# EAGLE design Player (EAGLE 7.4.0)
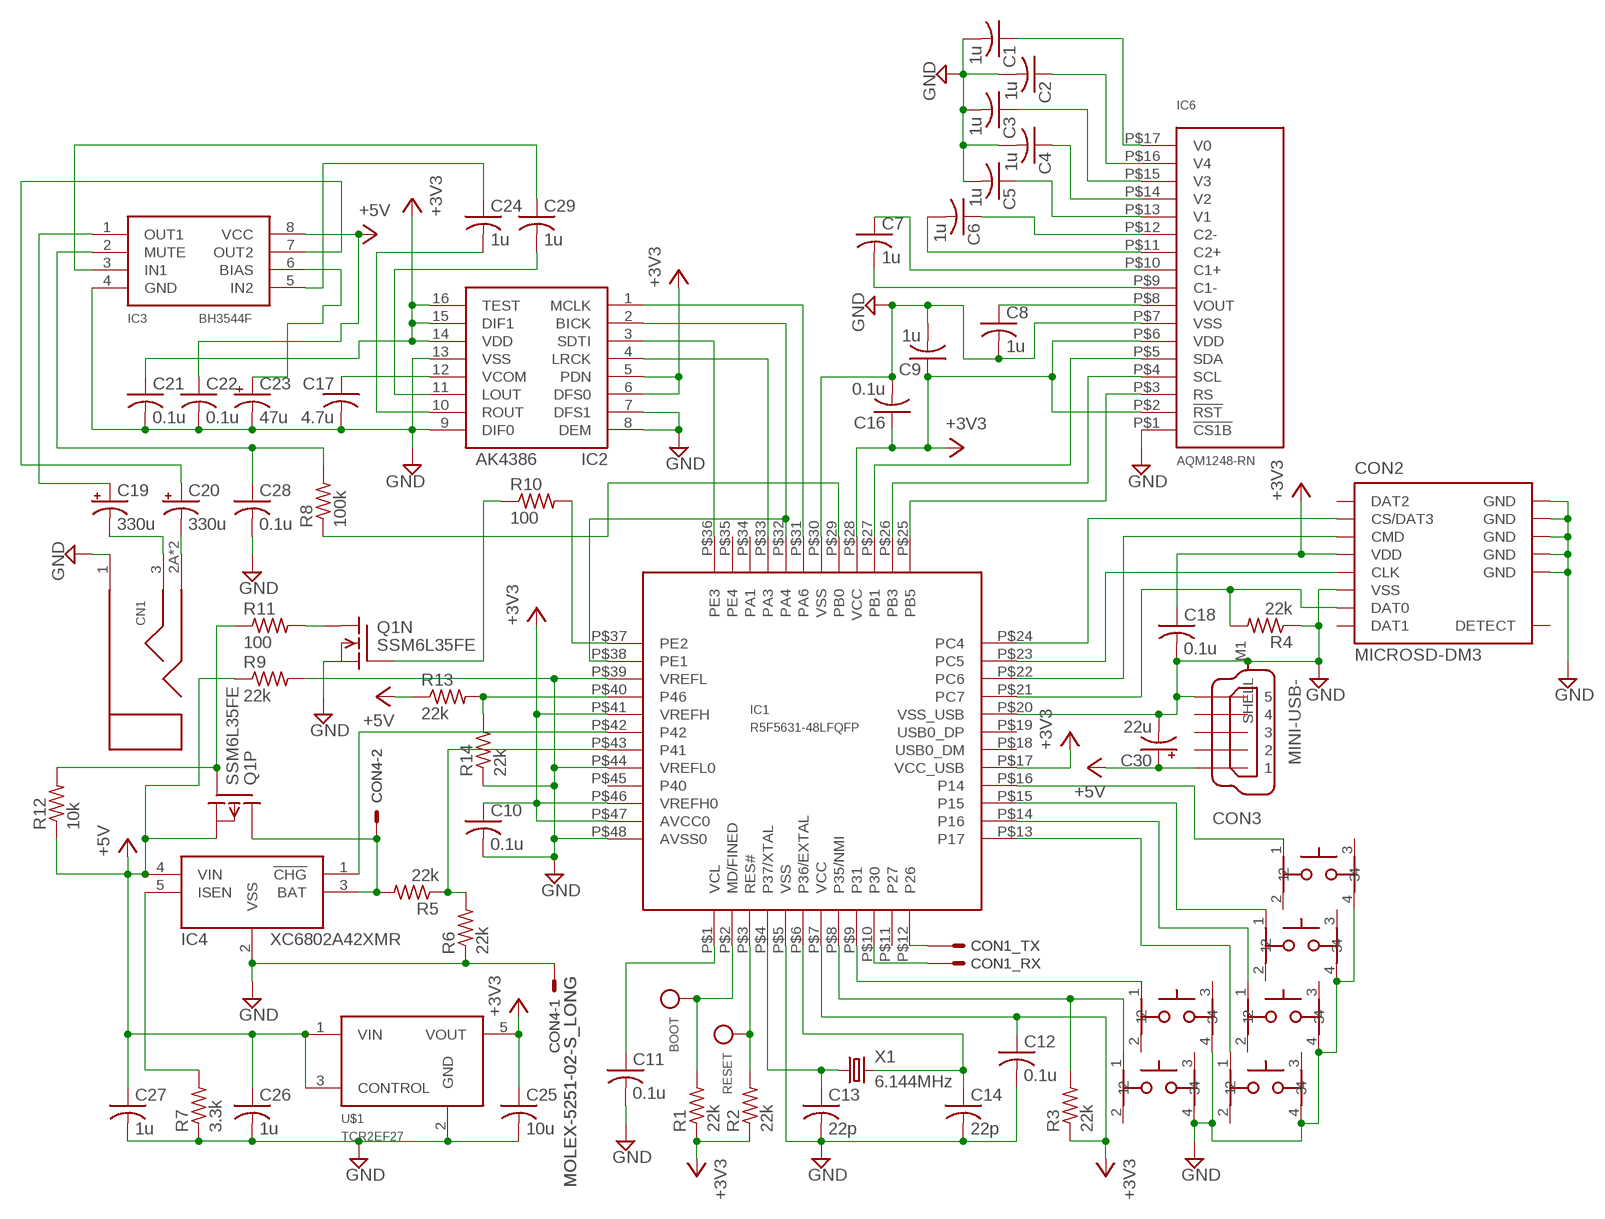
[diagram p0: schematic, sheet 1]

## Parts
BOOT  CHECK_PIN  [SLC-22-G]
C1  1u  C-2012  [2012-C]
C2  1u  C-2012  [2012-C]
C3  1u  C-2012  [2012-C]
C4  1u  C-2012  [2012-C]
C5  1u  C-2012  [2012-C]
C6  1u  C-2012  [2012-C]
C7  1u  C-2012  [2012-C]
C8  1u  C-2012  [2012-C]
C9  1u  C-2012  [2012-C]
C10  0.1u  C-2012  [2012-C]
C11  0.1u  C-2012  [2012-C]
C12  0.1u  C-2012  [2012-C]
C13  22p  C-1608  [1608]
C14  22p  C-1608  [1608]
C16  0.1u  C-2012  [2012-C]
C17  4.7u  C-2012  [2012-C]
C18  0.1u  C-2012  [2012-C]
C19  330u  CC-2.5-8  [E2,5-8]
C20  330u  CC-2.5-8  [E2,5-8]
C21  0.1u  C-2012  [2012-C]
C22  0.1u  C-2012  [2012-C]
C23  47u  CC-2.5-8  [E2,5-8]
C24  1u  C-2012  [2012-C]
C25  10u  C-3216  [3216]
C26  1u  C-2012  [2012-C]
C27  1u  C-2012  [2012-C]
C28  0.1u  C-2012  [2012-C]
C29  1u  C-2012  [2012-C]
C30  22u  CC-2.5-8  [E2,5-8]
CN1  STEREO-3.5-MJ8435  [MJ8435]
CON1  UART-S  [IL-G-04-S]
CON2  MICROSD-DM3  [DM3AT-SF-PEJ]
CON3  MINI-USB-  [UX60A-MB-5ST]
CON4  MOLEX-5251-02-S_LONG  [5251-02-S_LONG]
IC1  R5F5631-48LFQFP  [P-LFQFP48-7X7-0.50]
IC2  AK4386  [TSSOP16]
IC3  BH3544F  [SOIC8]
IC4  XC6802A42XMR  [SOT23-5]
IC6  AQM1248-RN  [AQM1248A-RN]
Q1  SSM6L35FE  [2-2N1D]
R1  22k  R-2012  [2012-R]
R2  22k  R-2012  [2012-R]
R3  22k  R-2012  [2012-R]
R4  22k  R-2012  [2012-R]
R5  22k  R-2012  [2012-R]
R6  22k  R-2012  [2012-R]
R7  3.3k  R-2012  [2012-R]
R8  100k  R-2012  [2012-R]
R9  22k  R-2012  [2012-R]
R10  100  R-2012  [2012-R]
R11  100  R-2012  [2012-R]
R12  10k  R-2012  [2012-R]
R13  22k  R-2012  [2012-R]
R14  22k  R-2012  [2012-R]
RESET  CHECK_PIN  [SLC-22-G]
SW1  PUSHSW  [PUSHSW]
SW2  PUSHSW  [PUSHSW]
SW3  PUSHSW  [PUSHSW]
SW4  PUSHSW  [PUSHSW]
SW5  PUSHSW  [PUSHSW]
SW6  PUSHSW  [PUSHSW]
U$1  TCR2EF27  TCR2EF  [5-LEAD_TSOT]
X1  6.144MHz  CRYSTALTINY  [TINYCRYSTAL]

## Nets
+3V3: C9.1 C10.1 C12.1 C16.1 C18.1 C21.1 C25.1 CON2.4(VDD) IC1.P$7(VCC) IC1.P$17(VCC_USB) IC1.P$28(VCC) IC1.P$41(VREFH) IC1.P$46(VREFH0) IC1.P$47(AVCC0) IC2.5(PDN) IC2.6(DFS0) IC2.14(VDD) IC2.15(DIF1) IC2.16(TEST) IC6.P$2(!RST) IC6.P$6(VDD) R1.1 R2.1 R3.1 U$1.5(VOUT)
+5V: C22.1 C26.1 C27.1 C30.+ CON3.1 IC3.8(VCC) IC4.4(VIN) Q1.4(P:S) R9.1 R12.1 R13.1 U$1.1(VIN) U$1.3(CONTROL)
GND: C1.2 C2.2 C3.2 C4.2 C5.2 C8.2 C9.2 C10.2 C11.2 C12.2 C13.2 C14.2 C16.2 C17.2 C18.2 C21.2 C22.2 C23.- C25.2 C26.2 C27.2 C28.2 C30.- CN1.1(SLEEVE) CON2.6(VSS) CON2.SHELL1(GND) CON2.SHELL2(GND) CON2.SHELL3(GND) CON2.SHELL4(GND) CON2.SHELL5(GND) CON3.5 CON3.M1(SHELL) CON4.1 IC1.P$5(VSS) IC1.P$20(VSS_USB) IC1.P$30(VSS) IC1.P$39(VREFL) IC1.P$44(VREFL0) IC1.P$48(AVSS0) IC2.7(DFS1) IC2.8(DEM) IC2.9(DIF0) IC2.13(VSS) IC3.4(GND) IC4.2(VSS) IC6.P$1(!CS1B) IC6.P$7(VSS) Q1.1(N:S) R4.1 R6.1 R7.1 R9.2 R14.1 SW1.4 SW2.4 SW3.4 SW4.4 SW5.4 SW6.4 U$1.2(GND)
N$1: C1.1 IC6.P$17(V0)
N$2: C2.1 IC6.P$16(V4)
N$3: C3.1 IC6.P$15(V3)
N$4: C4.1 IC6.P$14(V2)
N$5: C5.1 IC6.P$13(V1)
N$6: C11.1 IC1.P$1(VCL)
N$7: C6.1 IC6.P$12(C2-)
N$8: C6.2 IC6.P$11(C2+)
N$9: C7.1 IC6.P$10(C1+)
N$10: C7.2 IC6.P$9(C1-)
N$11: C8.1 IC6.P$8(VOUT)
N$12: CON1.3(_TX:S) IC1.P$12(P26)
N$13: CON1.2(_RX:S) IC1.P$10(P30)
N$14: IC1.P$9(P31) SW2.1
N$15: IC1.P$8(P35/NMI) R3.2 SW1.1
N$16: CON2.5(CLK) IC1.P$23(PC5)
N$18: IC1.P$37(PE2) R10.2
N$19: Q1.2(N:G) R10.1
N$20: IC1.P$3(RES#) R2.2 RESET.SIGNAL
N$21: Q1.5(P:G) R11.1 R12.2
N$23: CON2.7(DAT0) IC1.P$21(PC7) R4.2
N$24: BOOT.SIGNAL IC1.P$2(MD/FINED) R1.2
N$25: IC1.P$16(P14) SW6.1
N$26: IC1.P$15(P15) SW5.1
N$27: IC1.P$14(P16) SW4.1
N$28: IC1.P$13(P17) SW3.1
N$29: CON2.3(CMD) IC1.P$22(PC6)
N$30: CON2.2(CS/DAT3) IC1.P$24(PC4)
N$31: C17.1 IC2.12(VCOM)
N$32: IC1.P$25(PB5) IC6.P$3(RS)
N$33: IC1.P$26(PB3) IC6.P$4(SCL)
N$34: IC1.P$27(PB1) IC6.P$5(SDA)
N$35: C24.2 IC2.10(ROUT)
N$36: C29.2 IC2.11(LOUT)
N$37: C20.+ IC3.7(OUT2)
N$38: C23.+ IC3.6(BIAS)
N$39: C19.+ IC3.1(OUT1)
N$40: C19.- CN1.3(RING)
N$41: C20.- CN1.2A(TIP) CN1.2B(TIP)
N$42: IC1.P$36(PE3) IC2.3(SDTI)
N$43: IC1.P$31(PA6) IC2.1(MCLK)
N$44: IC1.P$32(PA4) IC1.P$38(PE1) IC2.2(BICK)
N$45: IC1.P$33(PA3) IC2.4(LRCK)
N$46: C24.1 IC3.5(IN2)
N$47: Q1.6(N:D) R11.2
N$48: IC1.P$43(P41) R5.1 R6.2
N$49: IC1.P$42(P42) IC4.1(!CHG!)
N$50: CON4.2 IC4.3(BAT) Q1.3(P:D) R5.2
N$51: C29.1 IC3.3(IN1)
N$52: IC4.5(ISEN) R7.2
N$53: C28.1 IC3.2(MUTE) R8.2
N$54: IC1.P$29(PB0) R8.1
N$55: IC1.P$40(P46) R13.2 R14.2
N$56: C13.1 IC1.P$4(P37/XTAL) X1.1
N$57: C14.1 IC1.P$6(P36/EXTAL) X1.2
Unconnected: CON2.1(DAT2) CON2.8(DAT1) CON2.DETECT CON3.2 CON3.3 CON3.4 IC1.P$11(P27) IC1.P$18(USB0_DM) IC1.P$19(USB0_DP) IC1.P$34(PA1) IC1.P$35(PE4) IC1.P$45(P40) SW1.2 SW1.3 SW2.2 SW2.3 SW3.2 SW3.3 SW4.2 SW4.3 SW5.2 SW5.3 SW6.2 SW6.3

## Power pins joined to a net without a drawn wire
GND: CON1.1(_PWR:GND)
VCC: CON1.4(_PWR:VCC)

## Library data of the parts
BOOT RESET = Connector_Robotech:CHECK_PIN
C1-C14 C16-C18 C21 C22 C24-C29 = Passive_Robotech:C
C19 C20 C23 C30 = Passive_Robotech:CC
CN1 = Connector_Robotech:STEREO
CON1 = Connector_Robotech:UART: Robotech Universal Asynchronous Receiver Transmitter
CON2 = Connector_Robotech:MICROSD: microSD connector
CON3 = Connector_Robotech:MINI-USB-: MINI USB Connector Source: http://www.hirose.co.jp/cataloge_hp/e24000019.pdf
CON4 = Connector_Robotech:MOLEX-5251-02: CONNECTOR wire to board 2.54 mm (.1 inch) pitch header
IC1 = MicroControler_Robotech:R5F5631-48LFQFP
IC2 = IC_Robotech:AK4386
IC3 = IC_Robotech:BH3544F
IC4 = IC_Robotech:XC6802
IC6 = IC_Robotech:AQM1248-RN
Q1 = Transistor_Robotech:SSM6L35FE
R1-R14 = Passive_Robotech:R
SW1-SW6 = Passive_Robotech:PUSHSW
U$1 = IC_Robotech:TCR2EF
X1 = Passive_Robotech:CRYSTAL: CRYSTAL

## Board
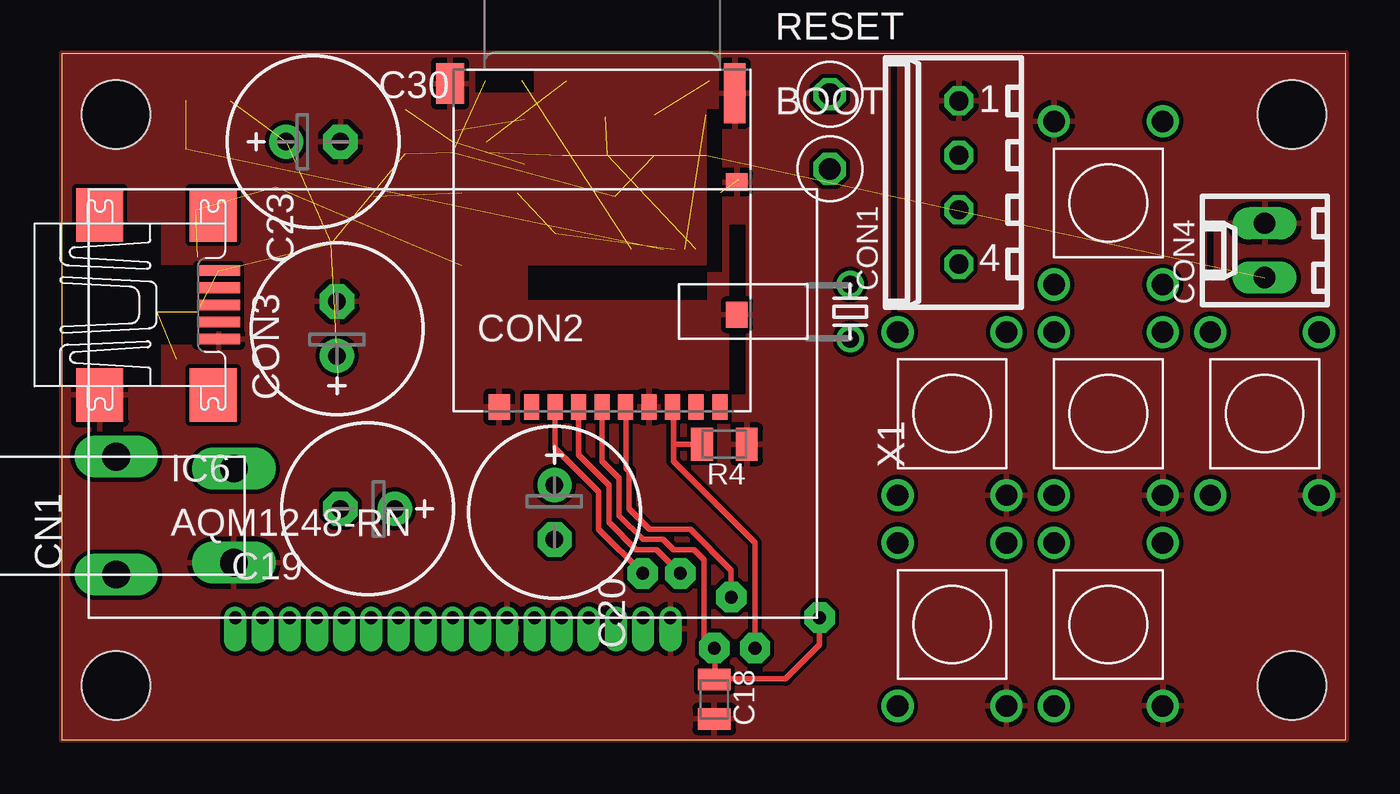
[diagram p1: board, top side]
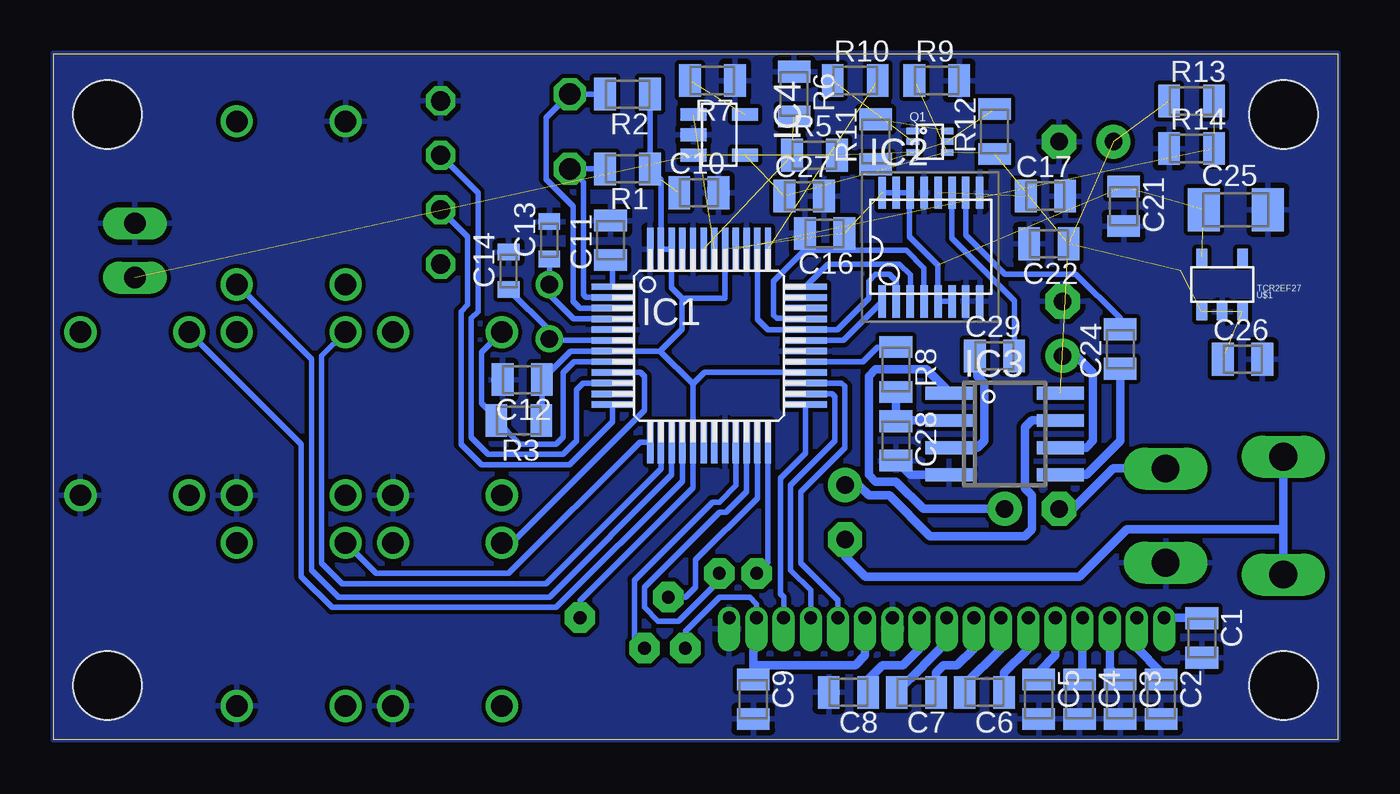
[diagram p2: board, bottom side, seen from below]

Size 59.99 x 32.06 mm. Coordinates in mm from the lower left corner, seen from the top.
Outline: 0,0 59.99,0 59.99,32.06 0,32.06 0,0
Copper layers (1*16): Top 0.0356mm / dielectric 1.5011mm / Bottom 0.0356mm
Design rules "formitaminimum *": minimum track width 5mil, minimum drill 0.5994mm, track to track 0.2007mm, track to pad 0.2007mm, pad to pad 0.2007mm, via to via 0.2007mm, smd to smd 0mil, copper to edge 0mil, drill to drill 1mil, minimum pad ring 9mil, minimum via ring 8mil, stop-mask expansion 4mil, vias tented up to drill 0mil, thermal gap 10mil
Holes 3.2 mm at 2.54,2.54 57.47,2.54 57.47,29.21 2.54,29.21

### Footprints (pad centres in the part's own frame; a part is rotated, then mirrored left to right if it is on the bottom)
SLC-22-G = drill 1 octagon: SIGNAL 0,0
2012-C = smd 1.016 x 1.524: 1 -0.921,0; 2 0.921,0
1608 = smd 0.762 x 1.016: 1 -0.875,0; 2 0.875,0
E2,5-8 = drill 0.813 pad 1.6: + -1.27,0 | drill 0.813 pad 1.6 octagon: - 1.27,0
3216 = smd 1.5 x 2: 1 -1.5,0; 2 1.5,0
MJ8435 = drill 1.3 long: 1 -2.2,-5.5; 2A -2.75,0; 2B 2.75,0; 3 2.2,-5.5
IL-G-04-S = drill 0.9 octagon: 1 3.81,0; 2 1.27,0; 3 -1.27,0; 4 -3.81,0
DM3AT-SF-PEJ = smd 0.7 x 1.2: 1 3.3,0; 2 2.2,0; 3 1.1,0; 4 0,0; 5 -1.1,0; 6 -2.2,0; 7 -3.3,0; 8 -4.4,0; DETECT -5.5,0 | smd 1 x 1.2: SHELL1 4.8,0; SHELL2 -6.3,-4.3 | smd 1 x 0.8: SHELL3 -6.3,-10.5 | smd 1 x 2.8: SHELL4 -6.2,-14.65 | smd 1.3 x 1.9: SHELL5 7.1,-15.1
UX60A-MB-5ST = smd 2 x 0.5: 1 2.25,1.6; 2 2.25,0.8; 3 2.25,0; 4 2.25,-0.8; 5 2.25,-1.6 | smd 2.2 x 2.5: M1 -3.3,-4.2; M2 -3.3,4.2; M3 2,4.2; M4 2,-4.2
5251-02-S_LONG = drill 1 long: 1 1.27,0; 2 -1.27,0
P-LFQFP48-7X7-0.50 = smd 2 x 0.3: P$1 -4.5,2.75; P$2 -4.5,2.25; P$3 -4.5,1.75; P$4 -4.5,1.25; P$5 -4.5,0.75; P$6 -4.5,0.25; P$7 -4.5,-0.25; P$8 -4.5,-0.75; P$9 -4.5,-1.25; P$10 -4.5,-1.75; P$11 -4.5,-2.25; P$12 -4.5,-2.75; P$25 4.5,-2.75; P$26 4.5,-2.25; P$27 4.5,-1.75; P$28 4.5,-1.25; P$29 4.5,-0.75; P$30 4.5,-0.25; P$31 4.5,0.25; P$32 4.5,0.75; P$33 4.5,1.25; P$34 4.5,1.75; P$35 4.5,2.25; P$36 4.5,2.75 | smd 0.3 x 2: P$13 -2.75,-4.5; P$14 -2.25,-4.5; P$15 -1.75,-4.5; P$16 -1.25,-4.5; P$17 -0.75,-4.5; P$18 -0.25,-4.5; P$19 0.25,-4.5; P$20 0.75,-4.5; P$21 1.25,-4.5; P$22 1.75,-4.5; P$23 2.25,-4.5; P$24 2.75,-4.5; P$37 2.75,4.5; P$38 2.25,4.5; P$39 1.75,4.5; P$40 1.25,4.5; P$41 0.75,4.5; P$42 0.25,4.5; P$43 -0.25,4.5; P$44 -0.75,4.5; P$45 -1.25,4.5; P$46 -1.75,4.5; P$47 -2.25,4.5; P$48 -2.75,4.5
TSSOP16 = smd 0.35 x 1.5: 1 0,0; 2 0.65,0; 3 1.3,0; 4 1.95,0; 5 2.6,0; 6 3.25,0; 7 3.9,0; 8 4.55,0; 9 4.55,5.08; 10 3.9,5.08; 11 3.25,5.08; 12 2.6,5.08; 13 1.95,5.08; 14 1.3,5.08; 15 0.65,5.08; 16 0,5.08
SOIC8 = smd 0.6 x 2.2: 1 -1.905,-2.6; 2 -0.635,-2.6; 3 0.635,-2.6; 4 1.905,-2.6; 5 1.905,2.6; 6 0.635,2.6; 7 -0.635,2.6; 8 -1.905,2.6
SOT23-5 = smd 0.6 x 1.2: 1 -0.95,-1.2; 2 0,-1.2; 3 0.95,-1.2; 4 0.95,1.2; 5 -0.95,1.2
AQM1248A-RN = drill 0.6 pad 0.9 offset: P$1 27.16,0; P$2 25.89,0; P$3 24.62,0; P$4 23.35,0; P$5 22.08,0; P$6 20.81,0; P$7 19.54,0; P$8 18.27,0; P$9 17,0; P$10 15.73,0; P$11 14.46,0; P$12 13.19,0; P$13 11.92,0; P$14 10.65,0; P$15 9.38,0; P$16 8.11,0; P$17 6.84,0
2-2N1D = smd 0.6 x 0.3: 1 -0.8,0.5; 2 -0.8,0; 3 -0.8,-0.5; 4 0.8,-0.5; 5 0.8,0; 6 0.8,0.5
2012-R = smd 1.016 x 1.524: 1 -1.048,0; 2 1.048,0
PUSHSW = drill 1: 1 -2.54,3.81; 2 -2.54,-3.81; 3 2.54,3.81; 4 2.54,-3.81
5-LEAD_TSOT = smd 0.5 x 0.8: 1 -0.95,-1.27; 2 0,-1.27; 3 0.95,-1.27; 4 0.95,1.27; 5 -0.95,1.27
TINYCRYSTAL = drill 0.813: 1 -1.27,0; 2 1.27,0

### Placement (x,y rotation side)
BOOT  35.88,26.67 0 top
C1  6.35,4.76 270 bottom
C2  8.26,1.91 270 bottom
C3  10.16,1.91 270 bottom
C4  12.06,1.91 270 bottom
C5  13.97,1.91 270 bottom
C6  16.51,2.22 180 bottom
C7  19.68,2.22 180 bottom
C8  22.86,2.22 180 bottom
C9  27.3,1.91 270 bottom
C10  29.84,25.56 0 bottom
C11  33.97,23.34 90 bottom
C12  38.1,16.83 180 bottom
C13  36.83,23.34 90 bottom
C14  38.73,21.91 90 bottom
C16  23.97,23.65 180 bottom
C17  13.65,25.4 0 bottom
C18  30.48,1.91 270 top
C19  14.29,10.79 180 top
C20  23.02,10.64 270 top
C21  10,24.92 270 bottom
C22  13.49,23.18 180 bottom
C23  12.86,19.21 90 top
C24  10.16,18.26 90 bottom
C25  4.76,24.77 0 bottom
C26  4.45,17.78 0 bottom
C27  24.92,25.4 0 bottom
C28  20.64,13.97 270 bottom
C29  16.03,17.94 0 bottom
C30  11.75,27.94 0 top
CN1  2.54,10.48 90 top
CON1  41.91,26.04 90 top
CON2  25.24,15.56 180 top
CON3  5.08,20.32 0 top
CON4  56.2,22.86 90 top
IC1  29.37,18.41 0 bottom
IC2  21.27,20.48 0 bottom
IC3  15.56,14.29 270 bottom
IC4  28.89,28.26 270 bottom
IC6  1.27,5.71 0 top
Q1  19.05,27.94 0 bottom
R1  33.18,26.67 180 bottom
R2  33.18,30.16 180 bottom
R3  38.26,14.92 180 bottom
R4  30.96,13.81 180 top
R5  24.45,27.3 0 bottom
R6  25.4,30.16 270 bottom
R7  29.21,30.8 180 bottom
R8  20.64,17.3 270 bottom
R9  18.73,30.8 0 bottom
R10  22.54,30.8 0 bottom
R11  21.59,27.94 90 bottom
R12  16.03,28.42 90 bottom
R13  6.83,29.84 0 bottom
R14  6.83,27.62 0 bottom
RESET  35.88,30.16 0 top
SW1  41.59,15.24 0 top
SW2  41.59,5.4 0 top
SW3  48.9,5.4 0 top
SW4  48.9,15.24 0 top
SW5  48.9,25.08 180 top
SW6  56.2,15.24 0 top
U$1  5.4,21.27 0 bottom
X1  36.83,20 270 top

### Tracks (layer width: path | path; a pad name or v marks a point on that pad's centre or on a via)
+3V3  (via drill 0.6 pad 1.42)  (6 unrouted)
  Top 0.254: CON2.4 25.24,13.02 26.04,12.22 26.04,10.48 27.15,9.37 28.1,9.37 28.57,8.89 29.53,8.89 30,8.41 30,4.76 v30.48,4.29 30.51,4.25 30.51,2.86 | v35.4,5.71 35.4,4.45 33.81,2.86 30.51,2.86 | 30.51,2.86 C18.1
  Bottom 0.254: IC1.P$41 28.62,20.64 30.64,20.64 | 30.64,20.64 31.12,21.12 IC1.P$46 IC1.P$47 31.62,26.16 R1.1 R2.1 | 30.12,16.62 31.66,18.16 | 31.66,18.16 IC1.P$7 35.84,18.16 C12.1 37.18,14.95 R3.1 | IC1.P$28 29.58,17.16 30.12,16.62 | IC2.6 IC2.5 18.67,22.16 20,23.5 20,25.53 IC2.14 IC2.15 IC2.16 | 30.64,20.64 30.64,19.18 31.66,18.16 | IC6.P$2 27.15,5.73 27.15,6.35 27.46,6.67 28.89,6.67 30.48,5.08 v30.48,4.29 | 30.12,16.62 IC1.P$17 30.12,11.79 35.4,6.51 v35.4,5.71
  Bottom 0.406: C9.1 27.3,3.49 | 27.3,3.49 27.3,5.57 IC6.P$2 | IC6.P$6 22.08,3.96 22.54,3.49 27.3,3.49
+5V  (12 unrouted)
GND
  Bottom 0.406: IC3.4 19.97,12.38 C28.2
  pour Bottom: 0,0 60.01,0 60.01,32.07 0,32.07
  pour Top: 0,0 60.01,0 60.01,32.07 0,32.07
N$1
  Bottom 0.406: IC6.P$17 6.38,5.71 C1.1
N$2
  Bottom 0.406: IC6.P$16 9.38,4.3 8.26,3.17 C2.1
N$3
  Bottom 0.406: IC6.P$15 10.65,3.32 C3.1
N$4
  Bottom 0.406: IC6.P$14 11.92,2.97 C4.1
N$5
  Bottom 0.406: IC6.P$13 13.19,3.96 13.97,3.17 C5.1
N$6
  Bottom 0.254: IC1.P$1 33.87,22.31 C11.1
N$7
  Bottom 0.406: IC6.P$12 14.46,4.27 15.59,3.14 C6.1
N$8
  Bottom 0.406: IC6.P$11 15.73,4.27 17.43,2.57 C6.2
N$9
  Bottom 0.406: C7.1 18.76,3.14 18.41,3.49 17.78,3.49 17,4.27 IC6.P$10
N$10
  Bottom 0.406: IC6.P$9 18.27,4.59 19.37,3.49 19.37,3.46 C7.2
N$11
  Bottom 0.406: IC6.P$8 19.54,4.27 20.32,3.49 21.27,3.49 21.91,2.86 21.91,2.25 C8.1
N$12
  Bottom 0.254: IC1.P$12 33.87,14.87 35.88,12.86 40.01,12.86 40.96,13.81 40.96,20 40.64,20.32 40.64,23.5 CON1.3
N$13
  Bottom 0.254: IC1.P$10 35.25,16.66 35.56,16.35 35.56,13.97 36.2,13.34 39.69,13.34 40.48,14.13 40.48,19.68 40.16,20 40.16,25.56 CON1.2
N$14
  Bottom 0.254: IC1.P$9 32.56,17.16 32.38,16.99 32.38,15.4 38.58,9.21 SW2.1
N$15
  Bottom 0.254: SW1.1 40.01,18.1 40.01,15.72 39.31,15.02 R3.2 38.2,13.81 36.51,13.81 36.2,14.13 36.2,17.14 35.67,17.66 IC1.P$8
N$16  (via drill 0.6 pad 1.42)
  Top 0.254: CON2.5 26.35,15.55 26.35,12.7 26.51,12.54 26.51,10.79 27.46,9.84 29.37,9.84 31.27,7.94 v31.27,6.67
  Bottom 0.254: IC1.P$23 27.12,11.3 30,8.41 30,7.14 30.48,6.67 v31.27,6.67
N$18  (1 unrouted)
N$19  (1 unrouted)
N$20
  Bottom 0.254: R2.2 RESET.SIGNAL 36.99,29.05 36.99,26.19 35.72,24.92 35.72,20.48 35.41,20.16 IC1.P$3
N$21  (2 unrouted)
N$23  (via drill 0.6 pad 1.42)
  Top 0.254: v32.38,4.29 32.38,9.21 28.57,13.02 28.57,13.81 | 28.57,13.81 28.57,15.52 CON2.7 | R4.2 28.57,13.81
  Bottom 0.254: IC1.P$21 28.12,11.89 28.89,11.11 29.21,11.11 32.86,7.46 32.86,4.76 v32.38,4.29
N$24
  Bottom 0.254: R1.2 BOOT.SIGNAL 35.24,26.04 35.24,20.8 35.11,20.66 IC1.P$2
N$25
  Bottom 0.254: IC1.P$16 30.62,12.09 36.51,6.19 46.99,6.19 48.42,7.62 48.42,13.81 SW6.1
N$26
  Bottom 0.254: IC1.P$15 31.12,12.38 36.83,6.67 46.67,6.67 47.94,7.94 47.94,17.78 SW5.1
N$27
  Bottom 0.254: IC1.P$14 31.62,12.67 36.99,7.3 46.51,7.3 47.47,8.26 47.47,17.94 SW4.1
N$28
  Bottom 0.254: IC1.P$13 32.6,13.91 38.73,7.78 44.93,7.78 SW3.1
N$29  (via drill 0.6 pad 1.42)
  Top 0.254: CON2.3 24.14,13.32 25.56,11.91 25.56,10.16 26.83,8.89 27.78,8.89 v28.89,7.78
  Bottom 0.254: IC1.P$22 27.62,11.59 28.57,10.64 28.89,10.64 32.38,7.14 32.38,6.19 31.75,5.56 30.8,5.56 28.89,7.46 v28.89,7.78
N$30  (via drill 0.6 pad 1.42)
  Top 0.254: CON2.2 23.04,13.63 25.08,11.59 25.08,9.84 v27.15,7.78
  Bottom 0.254: IC1.P$24 26.62,8.31 v27.15,7.78
N$31  (1 unrouted)
N$32
  Bottom 0.254: IC1.P$25 24.87,13.39 26.04,12.22 26.04,6.83 25.88,6.67 25.88,5.73 IC6.P$3
N$33
  Bottom 0.254: IC1.P$26 23.63,16.16 23.5,16.03 23.5,13.97 25.56,11.91 25.56,7.94 24.61,6.99 24.61,5.73 IC6.P$4
N$34
  Bottom 0.254: IC1.P$27 23.17,16.66 23.02,16.51 23.02,13.65 25.08,11.59 25.08,8.26 23.35,6.52 IC6.P$5
N$35
  Bottom 0.254: C24.2 10.16,19.68 12.22,21.75 15.56,21.75 17.37,23.56 IC2.10
N$36
  Bottom 0.254: C29.2 15.11,20.51 18.02,23.42 IC2.11
N$37
  Bottom 0.406: IC3.7 14.29,14.92 14.61,14.61 14.61,11.75 14.29,11.43 14.29,9.84 14.61,9.53 19.05,9.53 20.95,11.43 21.91,11.43 22.38,11.91 C20.+
N$38
  Bottom 0.406: IC3.6 11.75,13.65 11.43,13.97 11.43,17.14 12.22,17.94 C23.+
N$39
  Bottom 0.406: IC3.1 18.16,16.25 19.21,17.3 21.59,17.3 21.91,16.99 21.91,12.38 21.59,12.06 20.64,12.06 19.37,10.79 C19.+
N$40
  Bottom 0.406: C19.- 12.38,10.79 10.48,12.7 8.06,12.7 CN1.3
N$41
  Bottom 0.406: CN1.2A 2.54,9.84 | 2.54,9.84 CN1.2B | C20.- 23.02,8.57 22.07,7.62 12.06,7.62 9.84,9.84 2.54,9.84
N$42
  Bottom 0.254: IC2.3 19.97,21.72 20.48,22.23 23.81,22.23 IC1.P$36
N$43
  Bottom 0.254: IC2.1 23.09,18.66 IC1.P$31
N$44
  Bottom 0.254: IC1.P$38 27.12,19.66 26.63,19.16 IC1.P$32 23.38,19.16 21.91,20.64 21.91,21.43 21.59,21.75 20.95,21.75 20.62,21.42 IC2.2
N$45
  Bottom 0.254: IC2.4 19.32,22.02 20.16,22.86 24.92,22.86 26.35,21.43 26.35,19.84 26.19,19.68 24.89,19.68 IC1.P$33
N$46
  Bottom 0.406: IC3.5 11.75,12.38 10.16,13.97 C24.1
N$47  (1 unrouted)
N$48  (2 unrouted)
N$49  (1 unrouted)
N$50  (3 unrouted)
N$51
  Bottom 0.406: IC3.3 16.83,13.65 16.51,13.97 16.51,16.67 16.83,16.99 16.83,17.81 C29.1
N$52  (1 unrouted)
N$53
  Bottom 0.406: IC3.2 20.61,14.92 C28.1 R8.2
N$54
  Bottom 0.254: IC1.P$29 22.18,17.66 21.5,18.35 R8.1
N$55  (2 unrouted)
N$56
  Bottom 0.254: IC1.P$4 35.7,19.66 36.83,20.8 X1.1 C13.1
N$57
  Bottom 0.254: C14.1 36.83,19.13 X1.2 36.76,18.66 IC1.P$6